# EAGLE design untitled (EAGLE 6.3)

## Sheet 1 of 2
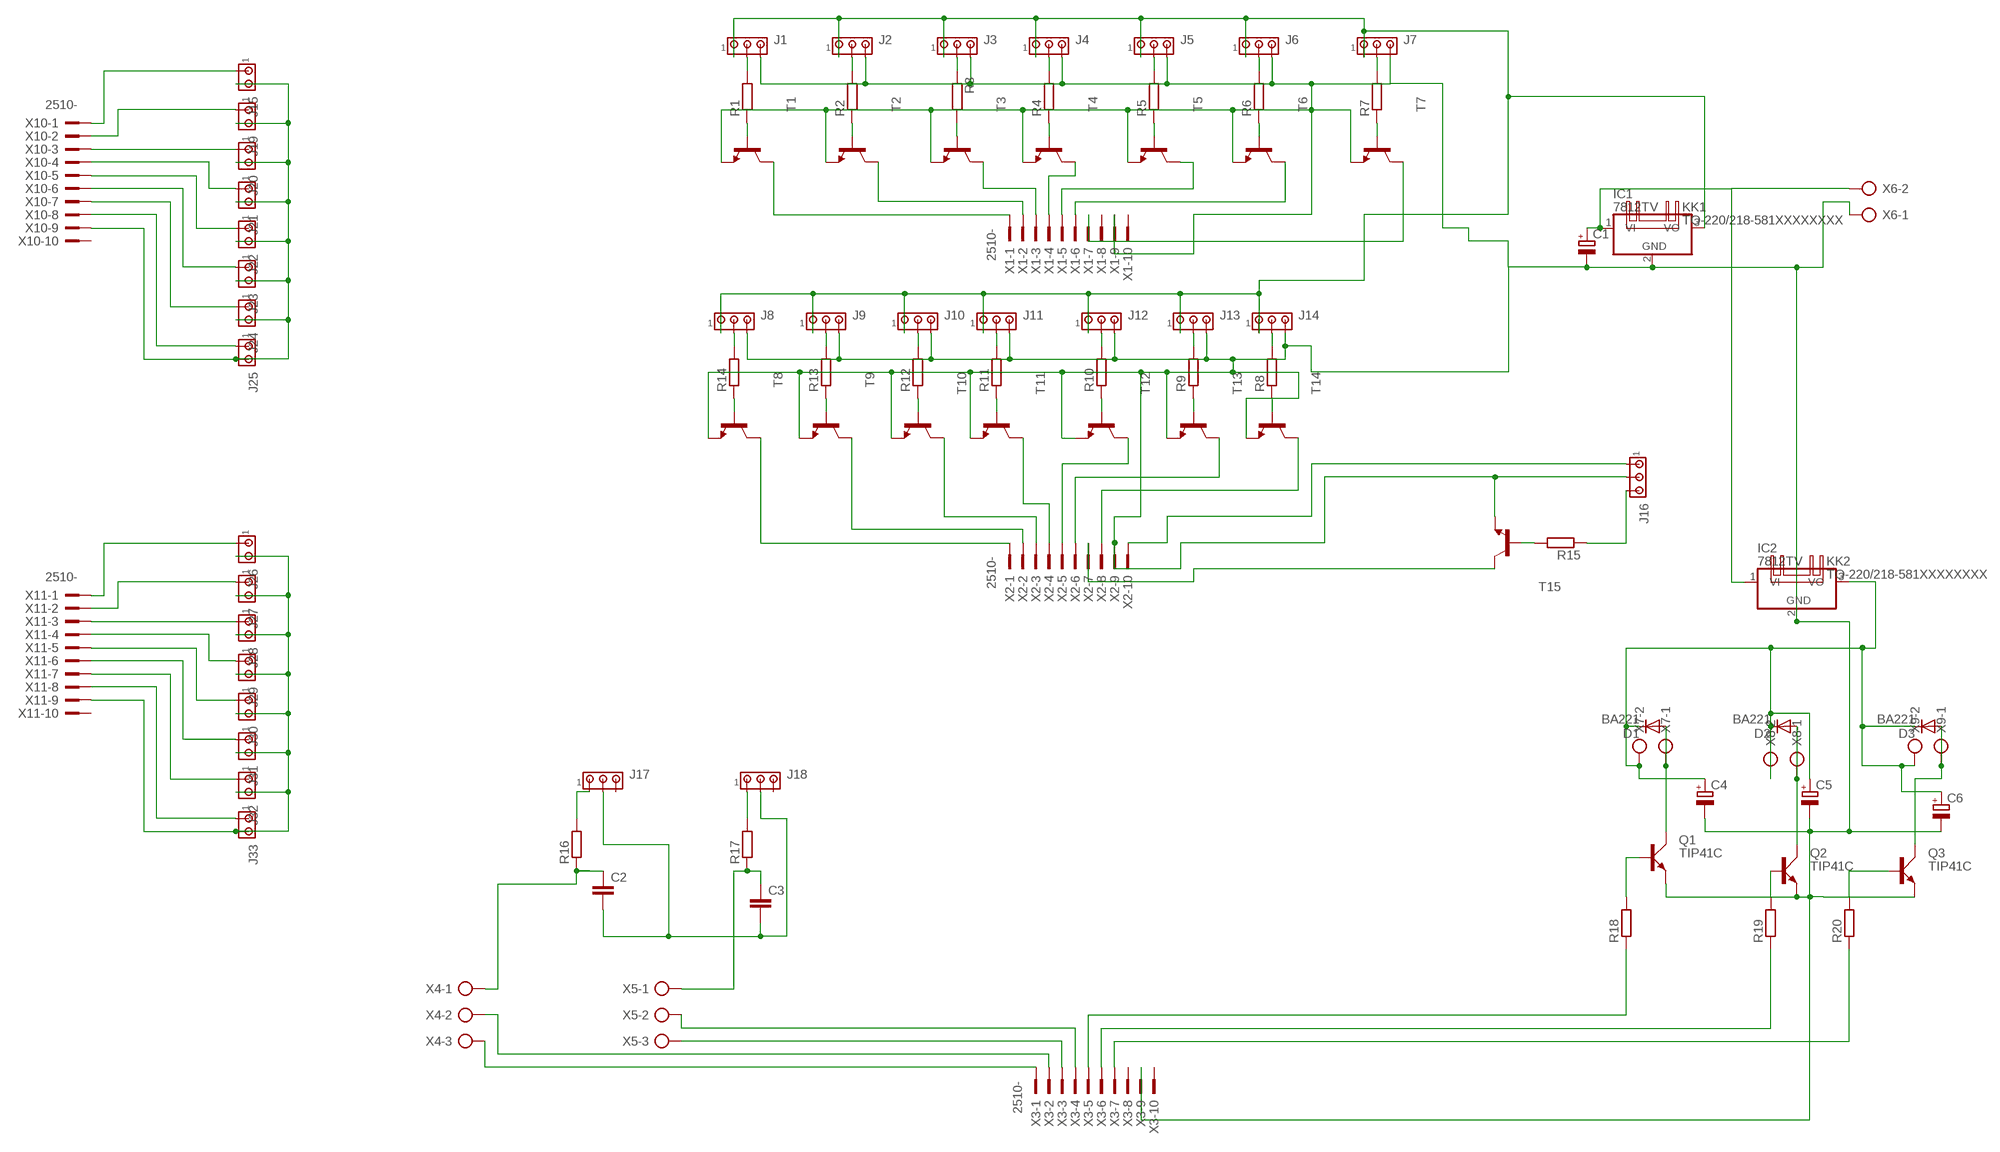
[diagram p0: schematic, sheet 1]

### Parts
C1  CPOL-EUE5-10.5  [E5-10,5]
C2  C-EU375-192X418  [C375-192X418]
C3  C-EU375-192X418  [C375-192X418]
C4  CPOL-EUE5-13  [E5-13]
C5  CPOL-EUE5-13  [E5-13]
C6  CPOL-EUE5-13  [E5-13]
D1  BA221  [DO35-10]
D2  BA221  [DO35-10]
D3  BA221  [DO35-10]
IC1  7812TV  [TO220V]
IC2  7812TV  [TO220V]
J1  MTA03-100  [10X03MTA]
J2  MTA03-100  [10X03MTA]
J3  MTA03-100  [10X03MTA]
J4  MTA03-100  [10X03MTA]
J5  MTA03-100  [10X03MTA]
J6  MTA03-100  [10X03MTA]
J7  MTA03-100  [10X03MTA]
J8  MTA03-100  [10X03MTA]
J9  MTA03-100  [10X03MTA]
J10  MTA03-100  [10X03MTA]
J11  MTA03-100  [10X03MTA]
J12  MTA03-100  [10X03MTA]
J13  MTA03-100  [10X03MTA]
J14  MTA03-100  [10X03MTA]
J15  MTA02-100  [10X02MTA]
J16  MTA03-100  [10X03MTA]
J17  MTA03-100  [10X03MTA]
J18  MTA03-100  [10X03MTA]
J19  MTA02-100  [10X02MTA]
J20  MTA02-100  [10X02MTA]
J21  MTA02-100  [10X02MTA]
J22  MTA02-100  [10X02MTA]
J23  MTA02-100  [10X02MTA]
J24  MTA02-100  [10X02MTA]
J25  MTA02-100  [10X02MTA]
J26  MTA02-100  [10X02MTA]
J27  MTA02-100  [10X02MTA]
J28  MTA02-100  [10X02MTA]
J29  MTA02-100  [10X02MTA]
J30  MTA02-100  [10X02MTA]
J31  MTA02-100  [10X02MTA]
J32  MTA02-100  [10X02MTA]
J33  MTA02-100  [10X02MTA]
KK1  TO-220/218-581XXXXXXXX  [581XXXXXXXX]
KK2  TO-220/218-581XXXXXXXX  [581XXXXXXXX]
Q1  TIP41C  [TO220AV]
Q2  TIP41C  [TO220AV]
Q3  TIP41C  [TO220AV]
R1  R-EU_0207/10  [0207/10]
R2  R-EU_0207/10  [0207/10]
R3  R-EU_0207/10  [0207/10]
R4  R-EU_0207/10  [0207/10]
R5  R-EU_0207/10  [0207/10]
R6  R-EU_0207/10  [0207/10]
R7  R-EU_0207/10  [0207/10]
R8  R-EU_0207/10  [0207/10]
R9  R-EU_0207/10  [0207/10]
R10  R-EU_0207/10  [0207/10]
R11  R-EU_0207/10  [0207/10]
R12  R-EU_0207/10  [0207/10]
R13  R-EU_0207/10  [0207/10]
R14  R-EU_0207/10  [0207/10]
R15  R-EU_0207/10  [0207/10]
R16  R-EU_0207/10  [0207/10]
R17  R-EU_0207/10  [0207/10]
R18  R-EU_0207/10  [0207/10]
R19  R-EU_0207/10  [0207/10]
R20  R-EU_0207/10  [0207/10]
T1  2N5401-NPN-TO92-CBE  [TO92-CBE]
T2  2N5401-NPN-TO92-CBE  [TO92-CBE]
T3  2N5401-NPN-TO92-CBE  [TO92-CBE]
T4  2N5401-NPN-TO92-CBE  [TO92-CBE]
T5  2N5401-NPN-TO92-CBE  [TO92-CBE]
T6  2N5401-NPN-TO92-CBE  [TO92-CBE]
T7  2N5401-NPN-TO92-CBE  [TO92-CBE]
T8  2N5401-NPN-TO92-CBE  [TO92-CBE]
T9  2N5401-NPN-TO92-CBE  [TO92-CBE]
T10  2N5401-NPN-TO92-CBE  [TO92-CBE]
T11  2N5401-NPN-TO92-CBE  [TO92-CBE]
T12  2N5401-NPN-TO92-CBE  [TO92-CBE]
T13  2N5401-NPN-TO92-CBE  [TO92-CBE]
T14  2N5401-NPN-TO92-CBE  [TO92-CBE]
T15  2N5401-NPN-TO92-CBE  [TO92-CBE]
X1  2510-  [PAK100/2500-10]
X2  2510-  [PAK100/2500-10]
X3  2510-  [PAK100/2500-10]
X4  AK300/3  [AK300/3]
X5  AK300/3  [AK300/3]
X6  AK300/2  [AK300/2]
X7  AK300/2  [AK300/2]
X8  AK300/2  [AK300/2]
X9  AK300/2  [AK300/2]
X10  2510-  [PAK100/2500-10]
X11  2510-  [PAK100/2500-10]

### Nets
N$1: R3.2 T3.B
N$2: R1.1 T1.B
N$3: J2.2 R2.2
N$4: J8.2 R14.2
N$5: J1.2 R1.2
N$6: R2.1 T2.B
N$7: J3.2 R3.1
N$8: J4.2 R4.2
N$9: R4.1 T4.B
N$10: R5.1 T5.B
N$11: J5.2 R5.2
N$12: J6.2 R6.2
N$13: R6.1 T6.B
N$14: J7.2 R7.2
N$15: R7.1 T7.B
N$16: J13.2 R9.2
N$17: R9.1 T13.B
N$18: R8.1 T14.B
N$19: J14.2 R8.2
N$20: J12.2 R10.2
N$21: R10.1 T12.B
N$22: R11.1 T11.B
N$23: J11.2 R11.2
N$24: J10.2 R12.2
N$25: R12.1 T10.B
N$26: R13.1 T9.B
N$27: J9.2 R13.2
N$28: R14.1 T8.B
N$29: T5.C X1.5
N$30: T8.C X2.1
N$31: T9.C X2.2
N$32: T1.C X1.1
N$33: T10.C X2.3
N$34: T11.C X2.4
N$35: T12.C X2.5
N$37: T13.C X2.6
N$38: J16.1 X2.10
N$39: T2.C X1.2
N$40: T3.C X1.3
N$41: T4.C X1.4
N$43: T6.C X1.6
N$44: T7.C X1.7
N$46: D1.A Q1.C X7.1
N$47: IC1.3(VO) J1.1 J2.1 J3.1 J4.1 J5.1 J6.1 J7.1 J8.1 J9.1 J10.1 J11.1 J12.1 J13.1 J14.1
N$48: T14.C X2.8
N$49: C1.+ IC1.1(VI) IC2.1(VI) X6.2
N$51: J16.3 R15.1
N$52: R15.2 T15.B
N$53: T15.C X2.7
N$54: Q1.B R18.2
N$55: D2.A Q2.C X8.1
N$56: Q2.B R19.2
N$57: Q3.B R20.2
N$58: C1.- C4.- C5.- C6.- IC1.2(GND) IC2.2(GND) J1.3 J2.3 J3.3 J4.3 J5.3 J6.3 J7.3 J8.3 J9.3 J10.3 J11.3 J12.3 J13.3 J14.3 J16.2 Q1.E Q2.E Q3.E T1.E T2.E T3.E T4.E T5.E T6.E T7.E T8.E T9.E T10.E T11.E T12.E T13.E T14.E T15.E X1.9 X2.9 X3.9 X6.1
N$59: D3.A Q3.C X9.1
N$60: J17.1 R16.2
N$61: C4.+ C5.+ C6.+ D1.C D2.C D3.C IC2.3(VO) X7.2 X8.2 X9.2
N$62: C2.1 R16.1 X4.1
N$63: J18.1 R17.2
N$64: C3.1 R17.1 X5.1
N$65: C2.2 C3.2 J17.2 J18.2
N$68: J15.1 X10.1
N$69: J19.1 X10.2
N$70: X3.1 X4.3
N$71: X3.2 X4.2
N$72: X3.3 X5.3
N$73: X3.4 X5.2
N$74: R18.1 X3.5
N$75: R19.1 X3.6
N$76: R20.1 X3.7
N$77: J20.1 X10.3
N$78: J21.1 X10.4
N$79: J22.1 X10.5
N$80: J23.1 X10.6
N$81: J24.1 X10.7
N$82: J25.1 X10.8
N$83: J15.2 J19.2 J20.2 J21.2 J22.2 J23.2 J24.2 J25.2 X10.9
N$84: J26.1 X11.1
N$85: J27.1 X11.2
N$86: J28.1 X11.3
N$87: J29.1 X11.4
N$88: J30.1 X11.5
N$89: J31.1 X11.6
N$90: J32.1 X11.7
N$91: J33.1 X11.8
N$92: J26.2 J27.2 J28.2 J29.2 J30.2 J31.2 J32.2 J33.2 X11.9
Unconnected: J17.3 J18.3 X1.8 X1.10 X3.8 X3.10 X10.10 X11.10

## Sheet 2 of 2
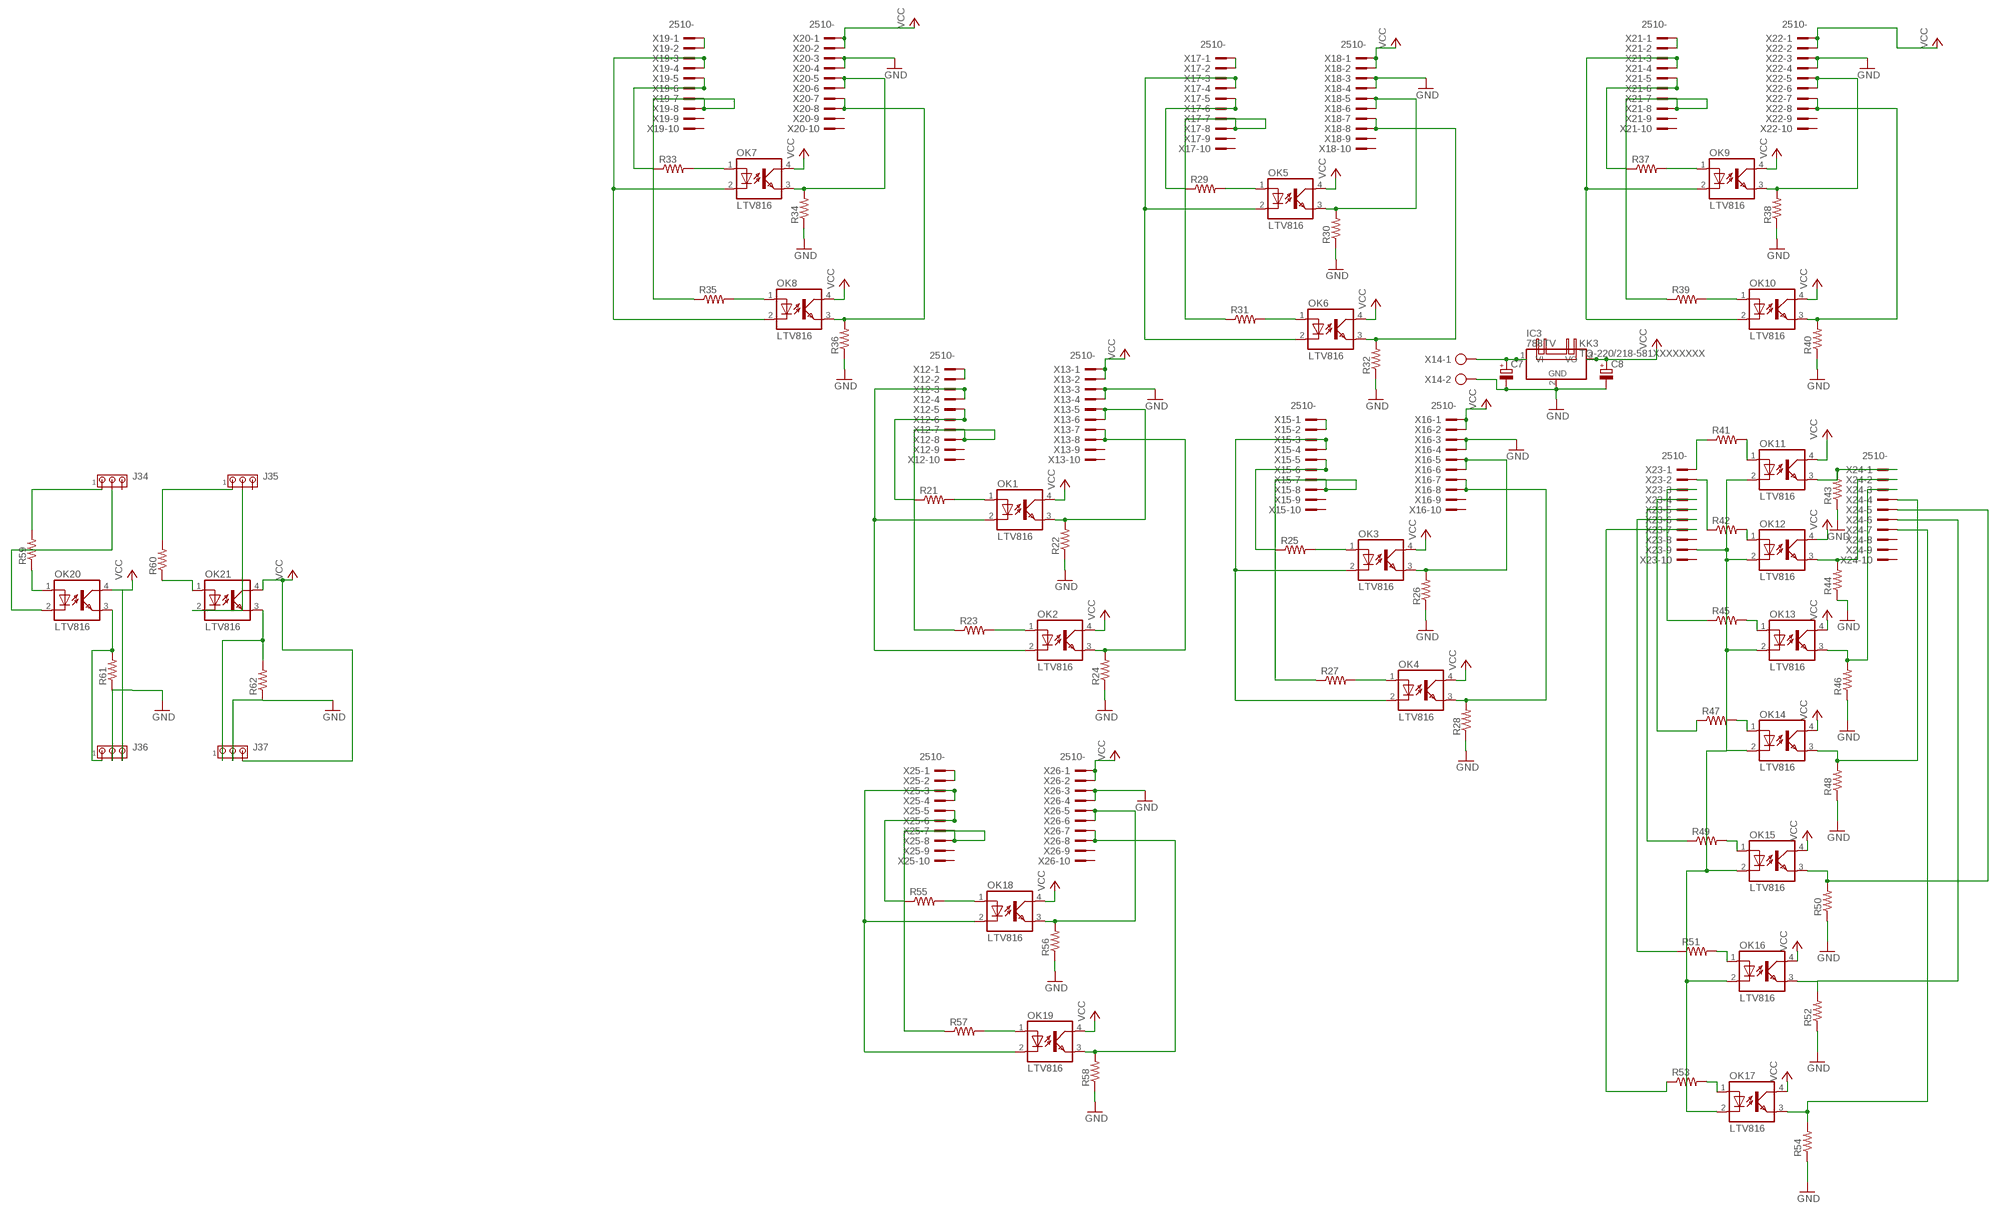
[diagram p1: schematic, sheet 2]

### Parts
C7  CPOL-EUE5-13  [E5-13]
C8  CPOL-EUE5-10.5  [E5-10,5]
IC3  788TV  [TO220V]
J34  MTA03-100  [10X03MTA]
J35  MTA03-100  [10X03MTA]
J36  MTA03-100  [10X03MTA]
J37  MTA03-100  [10X03MTA]
KK3  TO-220/218-581XXXXXXXX  [581XXXXXXXX]
OK1  LTV816  [DIL04]
OK2  LTV816  [DIL04]
OK3  LTV816  [DIL04]
OK4  LTV816  [DIL04]
OK5  LTV816  [DIL04]
OK6  LTV816  [DIL04]
OK7  LTV816  [DIL04]
OK8  LTV816  [DIL04]
OK9  LTV816  [DIL04]
OK10  LTV816  [DIL04]
OK11  LTV816  [DIL04]
OK12  LTV816  [DIL04]
OK13  LTV816  [DIL04]
OK14  LTV816  [DIL04]
OK15  LTV816  [DIL04]
OK16  LTV816  [DIL04]
OK17  LTV816  [DIL04]
OK18  LTV816  [DIL04]
OK19  LTV816  [DIL04]
OK20  LTV816  [DIL04]
OK21  LTV816  [DIL04]
R21  R-US_0207/10  [0207/10]
R22  R-US_0207/10  [0207/10]
R23  R-US_0207/10  [0207/10]
R24  R-US_0207/10  [0207/10]
R25  R-US_0207/10  [0207/10]
R26  R-US_0207/10  [0207/10]
R27  R-US_0207/10  [0207/10]
R28  R-US_0207/10  [0207/10]
R29  R-US_0207/10  [0207/10]
R30  R-US_0207/10  [0207/10]
R31  R-US_0207/10  [0207/10]
R32  R-US_0207/10  [0207/10]
R33  R-US_0207/10  [0207/10]
R34  R-US_0207/10  [0207/10]
R35  R-US_0207/10  [0207/10]
R36  R-US_0207/10  [0207/10]
R37  R-US_0207/10  [0207/10]
R38  R-US_0207/10  [0207/10]
R39  R-US_0207/10  [0207/10]
R40  R-US_0207/10  [0207/10]
R41  R-US_0207/10  [0207/10]
R42  R-US_0207/10  [0207/10]
R43  R-US_0207/10  [0207/10]
R44  R-US_0207/10  [0207/10]
R45  R-US_0207/10  [0207/10]
R46  R-US_0207/10  [0207/10]
R47  R-US_0207/10  [0207/10]
R48  R-US_0207/10  [0207/10]
R49  R-US_0207/10  [0207/10]
R50  R-US_0207/10  [0207/10]
R51  R-US_0207/10  [0207/10]
R52  R-US_0207/10  [0207/10]
R53  R-US_0207/10  [0207/10]
R54  R-US_0207/10  [0207/10]
R55  R-US_0207/10  [0207/10]
R56  R-US_0207/10  [0207/10]
R57  R-US_0207/10  [0207/10]
R58  R-US_0207/10  [0207/10]
R59  R-US_0207/10  [0207/10]
R60  R-US_0207/10  [0207/10]
R61  R-US_0207/10  [0207/10]
R62  R-US_0207/10  [0207/10]
X12  2510-  [PAK100/2500-10]
X13  2510-  [PAK100/2500-10]
X14  AK300/2  [AK300/2]
X15  2510-  [PAK100/2500-10]
X16  2510-  [PAK100/2500-10]
X17  2510-  [PAK100/2500-10]
X18  2510-  [PAK100/2500-10]
X19  2510-  [PAK100/2500-10]
X20  2510-  [PAK100/2500-10]
X21  2510-  [PAK100/2500-10]
X22  2510-  [PAK100/2500-10]
X23  2510-  [PAK100/2500-10]
X24  2510-  [PAK100/2500-10]
X25  2510-  [PAK100/2500-10]
X26  2510-  [PAK100/2500-10]

### Nets
GND: C7.- C8.- IC3.2(GND) J36.2 J37.2 R22.1 R24.1 R26.1 R28.1 R30.1 R32.1 R34.1 R36.1 R38.1 R40.1 R43.1 R44.1 R46.1 R48.1 R50.1 R52.1 R54.1 R56.1 R58.1 R61.1 R62.1 X13.3 X13.4 X14.2 X16.3 X16.4 X18.3 X18.4 X20.3 X20.4 X22.3 X22.4 X26.3 X26.4
N$95: X12.1 X12.2
N$96: R21.1 X12.5 X12.6
N$97: C7.+ IC3.1(VI) X14.1
N$98: OK1.1(A) R21.2
N$99: OK1.3(EMIT) R22.2 X13.5 X13.6
N$100: OK1.2(C) OK2.2(C) X12.3 X12.4
N$101: R23.1 X12.7 X12.8
N$102: OK2.1(A) R23.2
N$103: OK2.3(EMIT) R24.2 X13.7 X13.8
N$104: X15.1 X15.2
N$105: R25.1 X15.5 X15.6
N$106: OK3.1(A) R25.2
N$107: OK3.3(EMIT) R26.2 X16.5 X16.6
N$108: OK3.2(C) OK4.2(C) X15.3 X15.4
N$109: R27.1 X15.7 X15.8
N$110: OK4.1(A) R27.2
N$111: OK4.3(EMIT) R28.2 X16.7 X16.8
N$112: X17.1 X17.2
N$113: R29.1 X17.5 X17.6
N$114: OK5.1(A) R29.2
N$115: OK5.3(EMIT) R30.2 X18.5 X18.6
N$116: OK5.2(C) OK6.2(C) X17.3 X17.4
N$117: R31.1 X17.7 X17.8
N$118: OK6.1(A) R31.2
N$119: OK6.3(EMIT) R32.2 X18.7 X18.8
N$120: X19.1 X19.2
N$121: R33.1 X19.5 X19.6
N$122: OK7.1(A) R33.2
N$123: OK7.3(EMIT) R34.2 X20.5 X20.6
N$124: OK7.2(C) OK8.2(C) X19.3 X19.4
N$125: R35.1 X19.7 X19.8
N$126: OK8.1(A) R35.2
N$127: OK8.3(EMIT) R36.2 X20.7 X20.8
N$128: X21.1 X21.2
N$129: R37.1 X21.5 X21.6
N$130: OK9.1(A) R37.2
N$131: OK9.3(EMIT) R38.2 X22.5 X22.6
N$132: OK9.2(C) OK10.2(C) X21.3 X21.4
N$133: R39.1 X21.7 X21.8
N$134: OK10.1(A) R39.2
N$135: OK10.3(EMIT) R40.2 X22.7 X22.8
N$136: R41.1 X23.1
N$137: OK11.1(A) R41.2
N$138: R42.1 X23.2
N$139: OK12.1(A) R42.2
N$140: R45.1 X23.3
N$141: OK13.1(A) R45.2
N$142: OK11.3(EMIT) R43.2 X24.1
N$143: OK12.3(EMIT) R44.2 X24.2
N$144: OK13.3(EMIT) R46.2 X24.3
N$145: OK14.1(A) R47.2
N$146: OK14.3(EMIT) R48.2 X24.4
N$147: OK15.1(A) R49.2
N$148: OK15.3(EMIT) R50.2 X24.5
N$149: OK16.1(A) R51.2
N$150: OK17.1(A) R53.2
N$151: OK11.2(C) OK12.2(C) OK13.2(C) OK14.2(C) OK15.2(C) OK16.2(C) OK17.2(C) X23.9
N$152: OK17.3(EMIT) R54.2 X24.7
N$153: R47.1 X23.4
N$154: R49.1 X23.5
N$155: R51.1 X23.6
N$156: R53.1 X23.7
N$157: OK16.3(EMIT) R52.2 X24.6
N$158: X25.1 X25.2
N$159: R55.1 X25.5 X25.6
N$160: OK18.1(A) R55.2
N$161: OK18.3(EMIT) R56.2 X26.5 X26.6
N$162: OK18.2(C) OK19.2(C) X25.3 X25.4
N$163: R57.1 X25.7 X25.8
N$164: OK19.1(A) R57.2
N$165: OK19.3(EMIT) R58.2 X26.7 X26.8
N$166: J34.1 R59.2
N$167: OK20.1(A) R59.1
N$168: J34.2 OK20.2(C)
N$169: J36.1 OK20.3(EMIT) R61.2
N$170: J35.1 R60.2
N$171: OK21.1(A) R60.1
N$172: J35.2 OK21.2(C)
N$173: J37.1 OK21.3(EMIT) R62.2
VCC: C8.+ IC3.3(VO) J36.3 J37.3 OK1.4(COL) OK2.4(COL) OK3.4(COL) OK4.4(COL) OK5.4(COL) OK6.4(COL) OK7.4(COL) OK8.4(COL) OK9.4(COL) OK10.4(COL) OK11.4(COL) OK12.4(COL) OK13.4(COL) OK14.4(COL) OK15.4(COL) OK16.4(COL) OK17.4(COL) OK18.4(COL) OK19.4(COL) OK20.4(COL) OK21.4(COL) X13.1 X13.2 X16.1 X16.2 X18.1 X18.2 X20.1 X20.2 X22.1 X22.2 X26.1 X26.2
Unconnected: J34.3 J35.3 X12.9 X12.10 X13.9 X13.10 X15.9 X15.10 X16.9 X16.10 X17.9 X17.10 X18.9 X18.10 X19.9 X19.10 X20.9 X20.10 X21.9 X21.10 X22.9 X22.10 X23.8 X23.10 X24.8 X24.9 X24.10 X25.9 X25.10 X26.9 X26.10

## Library data of the parts
C1 C7 C8 = qfm-trx1-24g:CPOL-EU: POLARIZED CAPACITOR, European symbol
C2 C3 = qfm-trx1-24g:C-EU: CAPACITOR, European symbol
C4-C6 = resistor:CPOL-EU: POLARIZED CAPACITOR, European symbol
D1-D3 = diode:BA221: DIODE high speed (Philips)
IC1-IC3 = linear:78*: Positive VOLTAGE REGULATOR Source: http://cache.national.com/ds/LM/LM78L05.pdf http://www.fairchildsemi.com/ds/LM/LM7805.pdf
J1-J14 J16-J18 J34-J37 = con-amp:MTA03-100: AMP connector
J15 J19-J33 = con-amp:MTA02-100: AMP connector
KK1-KK3 = heatsink-aavid:TO-220/218: HEATSINKS TO-220/218
OK1-OK21 = optocoupler:LTV816: OPTO COUPLER Source: LITEON, LTV816.pdf; OC_FARNELL: unknown; OC_NEWARK: unknown
Q1-Q3 = transistor-power:TIP41C: NPN TRANSISTOR
R1-R20 = rcl:R-EU_: RESISTOR, European symbol
R21-R62 = rcl:R-US_: RESISTOR, American symbol
T1-T15 = transistor:*-NPN-: NPN Transistror BF959 corrected 2008.03.06
X1-X3 X10-X13 X15-X26 = con-3m:2510-: 3M (TM) Pak 100 4-Wall Header Source: 3M; MF: 3M; MPN: 2510-6002UB; OC_FARNELL: 9838244; OC_NEWARK: 46F4725
X4 X5 = con-ptr500:AK300/3: CONNECTOR; OC_FARNELL: unknown; OC_NEWARK: unknown
X6-X9 X14 = con-ptr500:AK300/2: CONNECTOR; OC_FARNELL: unknown; OC_NEWARK: unknown

## Board
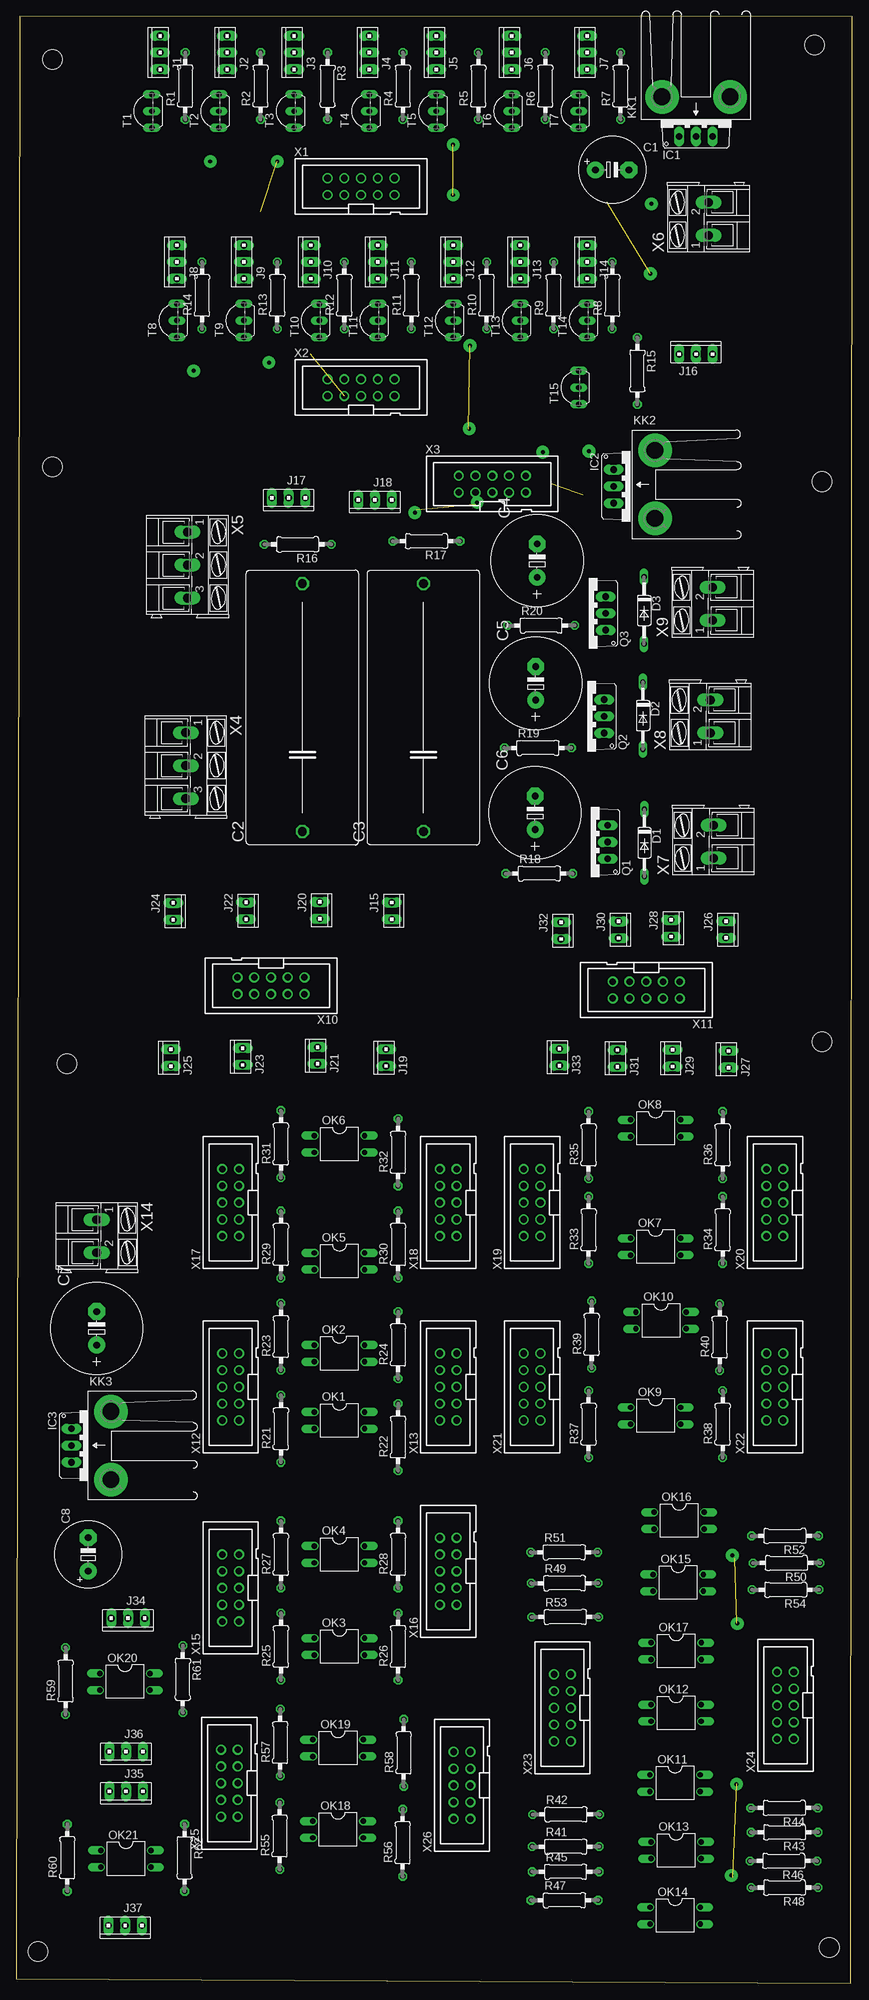
[diagram p2: board, top side]
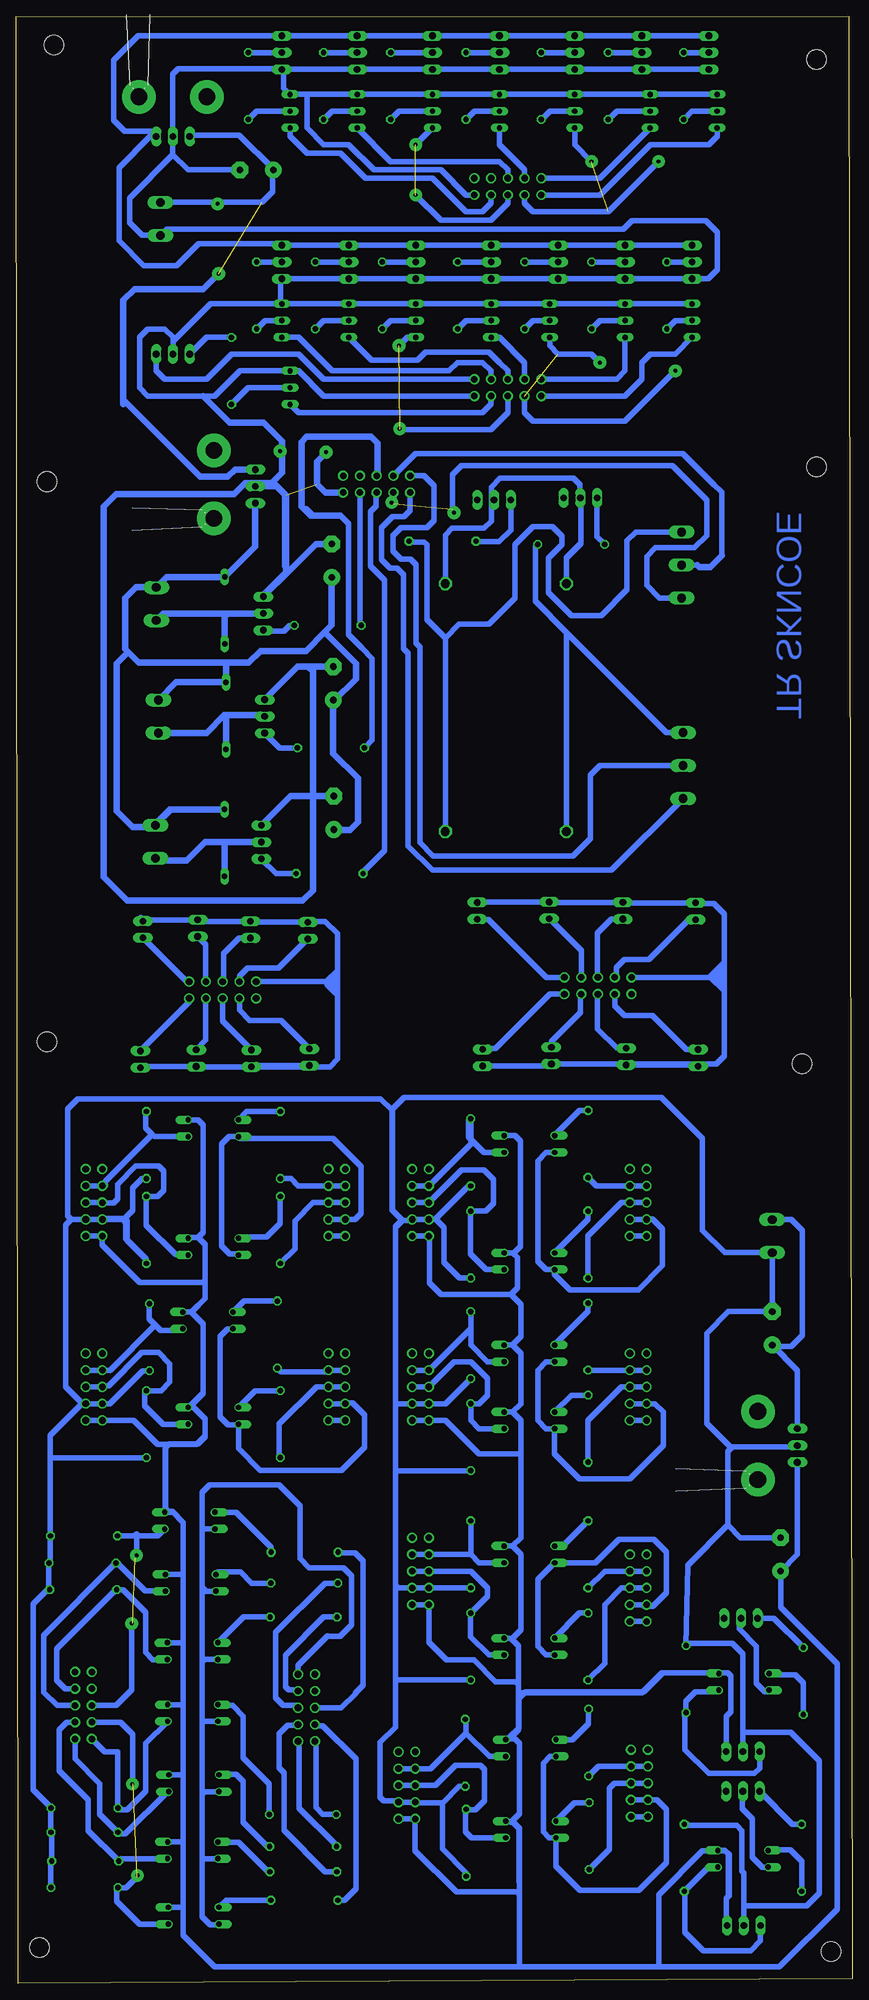
[diagram p3: board, bottom side, seen from below]

Size 126.8 x 298.2 mm. Coordinates in mm from the lower left corner, seen from the top.
Outline: 0,0.64 126.53,0 126.8,298.19 0.53,298.2 0,0.64
Copper layers (1*16): Top 0.035mm / dielectric 1.5mm / Bottom 0.035mm
Design rules "default": minimum track width 10mil, minimum drill 24mil, track to track 8mil, track to pad 8mil, pad to pad 8mil, via to via 8mil, smd to smd 8mil, copper to edge 40mil, drill to drill 8mil, minimum pad ring 10mil, minimum via ring 8mil, stop-mask expansion 4mil, vias tented up to drill 0mil, thermal gap 10mil
Holes 3 mm at 5.47,291.66 121.08,293.87 122.18,142.72 7.67,139.41 3.27,4.81 123.28,5.36 122.18,227.67 5.47,229.88

### Footprints (pad centres in the part's own frame; a part is rotated, then mirrored left to right if it is on the bottom)
E5-10,5 = drill 1.016 pad 2.54: + -2.54,0 | drill 1.016 pad 2.54 octagon: - 2.54,0
C375-192X418 = drill 1.321 octagon: 1 -18.796,0; 2 18.796,0
E5-13 = drill 1.016 pad 2.54: + -2.54,0 | drill 1.016 pad 2.54 octagon: - 2.54,0
DO35-10 = drill 0.813 long: A 5.08,0; C -5.08,0
TO220V = drill 1.016 long: 1 -2.54,-2.54; 2 0,-2.54; 3 2.54,-2.54
10X03MTA = drill 1.016 long: 1 2.54,0; 2 0,0; 3 -2.54,0
10X02MTA = drill 1.016 long: 1 1.27,0; 2 -1.27,0
581XXXXXXXX = drill 2.54 pad 5.08: A2,5 -5.16,3.45; B2,5 5.16,3.45
DIL04 = drill 0.813 offset: 1 -1.27,-3.81; 2 1.27,-3.81; 3 1.27,3.81; 4 -1.27,3.81
TO220AV = drill 1.016 long: B -2.54,-2.54; C 0,-2.54; E 2.54,-2.54
0207/10 = drill 0.813 octagon: 1 -5.08,0; 2 5.08,0
TO92-CBE = drill 0.813 long: B 0,0; C -2.54,0; E 2.54,0
PAK100/2500-10 = drill 1 pad 1.422: 1 -5.08,-1.27; 2 -5.08,1.27; 3 -2.54,-1.27; 4 -2.54,1.27; 5 0,-1.27; 6 0,1.27; 7 2.54,-1.27; 8 2.54,1.27; 9 5.08,-1.27; 10 5.08,1.27
AK300/3 = drill 1.321 long: 1 -5.004,0; 2 0,0; 3 5.004,0
AK300/2 = drill 1.321 long: 1 -2.515,0; 2 2.489,0

### Placement (x,y rotation side)
C1  90.37,274.94 0 top
C2  43.38,193.41 90 top
C3  61.74,193.41 90 top
C4  78.98,215.68 90 top
C5  78.75,197.09 90 top
C6  78.67,177.45 90 top
C7  12.16,99.28 90 top
C8  10.89,64.99 90 top
D1  95.24,172.9 270 top
D2  95.02,192.17 270 top
D3  95.19,208.13 270 top
IC1  103.07,282.56 0 top
IC2  93.12,226.94 270 top
IC3  10.89,81.5 270 top
J1  21.79,292.72 90 top
J2  31.95,292.72 90 top
J3  42.11,292.72 90 top
J4  53.54,292.72 90 top
J5  63.7,292.72 90 top
J6  75.13,292.72 90 top
J7  86.56,292.72 90 top
J8  24.33,260.97 90 top
J9  34.49,260.97 90 top
J10  44.65,260.97 90 top
J11  54.81,260.97 90 top
J12  66.24,260.97 90 top
J13  76.4,260.97 90 top
J14  86.56,260.97 90 top
J15  56.92,162.58 270 top
J16  103.07,247 0 top
J17  41.27,225.2 180 top
J18  54.36,224.89 180 top
J19  56.06,140.32 90 top
J20  45.99,162.66 270 top
J21  45.66,140.64 90 top
J22  34.82,162.6 270 top
J23  34.31,140.48 90 top
J24  23.77,162.52 270 top
J25  23.42,140.3 90 top
J26  107.61,159.75 270 top
J27  108.01,140.06 90 top
J28  99.31,159.95 270 top
J29  99.54,140.24 90 top
J30  91.32,159.73 270 top
J31  91.15,140.21 90 top
J32  82.6,159.58 270 top
J33  82.36,140.39 90 top
J34  16.91,55.31 180 top
J35  16.62,29.07 180 top
J36  16.62,35.1 180 top
J37  16.48,8.72 180 top
KK1  103.07,282.56 0 top
KK2  93.39,227.24 270 top
KK3  10.89,81.5 270 top
OK1  48.99,85.31 270 top
OK2  48.99,95.47 270 top
OK3  48.99,51.02 270 top
OK4  48.99,64.99 270 top
OK5  48.99,109.44 270 top
OK6  48.99,127.22 270 top
OK7  96.95,111.65 270 top
OK8  96.95,129.61 270 top
OK9  96.95,86.01 270 top
OK10  97.76,100.47 270 top
OK11  99.89,30.3 270 top
OK12  100.06,40.95 270 top
OK13  100.06,20.12 270 top
OK14  99.92,10.21 270 top
OK15  100.37,60.68 270 top
OK16  100.51,70.12 270 top
OK17  100.07,50.34 270 top
OK18  48.77,23.28 270 top
OK19  48.78,35.62 270 top
OK20  16.45,45.68 270 top
OK21  16.6,18.84 270 top
Q1  87.13,173 90 top
Q2  86.61,192.07 90 top
Q3  86.83,207.68 90 top
R1  25.6,287.64 90 top
R2  37.03,287.64 90 top
R3  47.19,287.64 270 top
R4  58.62,287.64 90 top
R5  70.05,287.64 90 top
R6  80.21,287.64 90 top
R7  91.64,287.64 90 top
R8  90.37,255.89 90 top
R9  81.48,255.89 90 top
R10  71.32,255.89 90 top
R11  59.89,255.89 90 top
R12  49.73,255.89 90 top
R13  39.57,255.89 90 top
R14  28.14,255.89 90 top
R15  94.18,244.46 270 top
R16  42.66,218.15 180 top
R17  62.18,218.64 180 top
R18  79.31,168.23 0 top
R19  79.09,187.29 0 top
R20  79.6,205.85 0 top
R21  40.1,84.04 90 top
R22  57.88,82.77 90 top
R23  40.1,98.01 90 top
R24  57.88,96.74 90 top
R25  40.1,51.02 90 top
R26  57.88,51.02 90 top
R27  40.1,64.99 90 top
R28  57.88,64.99 90 top
R29  40.1,111.98 90 top
R30  57.88,111.98 90 top
R31  40.1,127.22 90 top
R32  57.88,125.95 90 top
R33  86.79,114.19 90 top
R34  107.11,114.19 90 top
R35  86.79,127.07 90 top
R36  107.11,127.07 90 top
R37  86.79,84.74 90 top
R38  107.11,84.74 90 top
R39  87.25,98.34 90 top
R40  106.65,97.93 90 top
R41  83.32,20.67 0 top
R42  83.36,25.56 0 top
R43  116.5,22.86 180 top
R44  116.47,26.55 180 top
R45  83.31,16.87 0 top
R46  116.37,18.51 180 top
R47  83.13,12.55 0 top
R48  116.5,14.48 180 top
R49  83.15,60.64 0 top
R50  116.79,63.68 180 top
R51  83.09,65.32 0 top
R52  116.56,67.8 180 top
R53  83.25,55.5 0 top
R54  116.67,59.64 180 top
R55  39.93,22.28 90 top
R56  58.59,21.26 90 top
R57  40.01,36.46 90 top
R58  58.74,34.9 90 top
R59  7.44,45.78 90 top
R60  7.7,19 90 top
R61  25.24,46.07 270 top
R62  25.5,19 270 top
T1  20.52,283.83 90 top
T2  30.68,283.83 90 top
T3  42.11,283.83 90 top
T4  53.54,283.83 90 top
T5  63.7,283.83 90 top
T6  75.13,283.83 90 top
T7  85.29,283.83 90 top
T8  24.33,252.08 90 top
T9  34.49,252.08 90 top
T10  45.92,252.08 90 top
T11  54.81,252.08 90 top
T12  66.24,252.08 90 top
T13  76.4,252.08 90 top
T14  86.56,252.08 90 top
T15  85.29,241.92 90 top
X1  52.27,272.4 0 top
X2  52.27,241.92 0 top
X3  72.17,227.29 0 top
X4  25.67,184.61 270 top
X5  25.92,215.01 270 top
X6  104.98,267.51 90 top
X7  105.73,173.07 90 top
X8  105.25,192.07 90 top
X9  105.6,209.13 90 top
X10  38.6,151.23 180 top
X11  95.53,150.58 180 top
X12  32.48,90.39 90 top
X13  65.5,90.39 90 top
X14  12.16,113.25 270 top
X15  32.48,59.91 90 top
X16  65.5,62.45 90 top
X17  32.48,118.33 90 top
X18  65.5,118.33 90 top
X19  78.2,118.33 90 top
X20  115.03,118.33 90 top
X21  78.2,90.39 90 top
X22  115.03,90.39 90 top
X23  82.81,41.73 90 top
X24  116.64,42.08 90 top
X25  32.3,30.31 90 top
X26  67.58,29.97 90 top

### Tracks (layer width: path | path; a pad name or v marks a point on that pad's centre or on a via)
GND
  Bottom 0.813: R22.1 69.08,77.69 69.31,77.92 | 69.31,87.85 69.31,77.92 | 68.04,59.91 X16.3 X16.4 R28.1 68.95,59.91 69.31,60.27 | R24.1 61.69,87.85 X13.4 X13.3 69.31,87.85 | R32.1 58.24,120.87 63.25,115.87 | 63.25,115.87 64.15,115.87 X18.4 X18.3 66.92,115.64 68.27,115.64 | R30.1 59.61,106.9 61.95,109.24 61.95,114.57 63.25,115.87 | 69.31,87.85 69.31,114.6 | 69.31,114.6 68.27,115.64 | 68.27,115.64 69.79,117.16 69.79,132.56 68.04,134.31 28.98,134.31 22.74,128.07 22.74,114.12 19.38,110.76 X14.2 C7.- 18.82,101.82 22.1,98.54 22.1,84.83 18.55,81.29 18.22,81.29 | X20.3 114.26,115.79 | 114.26,115.79 X20.4 | R36.1 107.76,121.99 109.16,120.59 109.16,117.16 110.37,115.95 | 110.37,115.95 114.1,115.95 114.26,115.79 | 110.37,115.95 109.99,115.56 109.99,112.59 107.11,109.71 R34.1 107.11,109.81 110.21,112.91 110.21,115.28 110.72,115.79 118.48,115.79 | R40.1 107.63,92.85 112.67,87.8 113.72,87.8 X22.4 X22.3 116.34,87.88 116.79,87.88 | 18.22,81.29 8.57,81.29 IC3.2 | C8.- 16.97,67.53 18.89,69.45 | 18.89,69.45 18.89,80.61 18.22,81.29 | 118.48,115.79 119.32,114.94 119.32,90.41 116.79,87.88 | 69.31,114.6 69.31,114.7 68.31,115.71 69.85,117.25 69.85,132.37 71.56,134.08 117.5,134.08 119.04,132.54 119.04,116.35 118.48,115.79 | R58.1 59.65,29.82 62.12,27.35 | 62.12,27.35 66.23,27.35 X26.4 X26.3 69.02,27.6 71.1,27.6 71.64,28.14 71.64,36.46 69.31,38.79 69.31,45.86 | R56.1 58.59,16.72 62.2,20.33 62.2,27.27 62.12,27.35 | 69.31,77.92 69.31,60.27 | 69.31,60.27 69.31,45.86 | R26.1 69.24,45.94 69.31,45.86 | R48.1 121.58,18.37 R46.1 121.45,22.72 R43.1 121.58,26.51 R44.1 | 121.75,26.75 R44.1 | R44.1 124.26,29.26 124.26,57.53 122.15,59.64 R54.1 121.87,59.76 R50.1 121.64,63.91 R52.1 121.64,79.89
  Bottom 0.813: 18.89,69.45 24.98,63.36 R61.1 24.88,51.51 18.19,51.51 16.62,49.94 J36.2 16.62,38.01 16.58,38.05 9.35,38.05 5.03,33.73 5.03,13.6 6.89,11.73 16.4,11.73 16.48,11.81 | J37.2 16.48,11.81 | 16.48,11.81 16.48,16.69 16.74,16.95 16.74,23.1 17.53,23.9 25.32,23.9 R62.1 | 121.64,79.89 121.64,83.03 116.79,87.88 | R38.1 121.41,79.65 121.64,79.89
N$1
  Bottom 0.813: R3.2 45.92,283.83 T3.B
N$2
  Bottom 0.813: R1.1 24.33,283.83 T1.B
N$3
  Bottom 0.813: R2.2 J2.2
N$4
  Bottom 0.813: J8.2 R14.2
N$5
  Bottom 0.813: R1.2 J1.2
N$6
  Bottom 0.813: R2.1 35.76,283.83 T2.B
N$7
  Bottom 0.813: R3.1 J3.2
N$8
  Bottom 0.813: R4.2 J4.2
N$9
  Bottom 0.813: R4.1 57.35,283.83 T4.B
N$10
  Bottom 0.813: R5.1 68.78,283.83 T5.B
N$11
  Bottom 0.813: R5.2 J5.2
N$12
  Bottom 0.813: R6.2 J6.2
N$13
  Bottom 0.813: R6.1 78.94,283.83 T6.B
N$14
  Bottom 0.813: R7.2 J7.2
N$15
  Bottom 0.813: R7.1 90.37,283.83 T7.B
N$16
  Bottom 0.813: J13.2 R9.2
N$17
  Bottom 0.813: R9.1 80.21,252.08 T13.B
N$18
  Bottom 0.813: R8.1 89.1,252.08 T14.B
N$19
  Bottom 0.813: R8.2 J14.2
N$20
  Bottom 0.813: J12.2 R10.2
N$21
  Bottom 0.813: T12.B 70.05,252.08 R10.1
N$22
  Bottom 0.813: T11.B 58.62,252.08 R11.1
N$23
  Bottom 0.813: J11.2 R11.2
N$24
  Bottom 0.813: J10.2 R12.2
N$25
  Bottom 0.813: T10.B 48.46,252.08 R12.1
N$26
  Bottom 0.813: T9.B 38.3,252.08 R13.1
N$27
  Bottom 0.813: J9.2 R13.2
N$28
  Bottom 0.813: T8.B 26.87,252.08 R14.1
N$29  (via drill 0.6 pad 1.93)  (1 unrouted)
  Bottom 0.813: X1.5 52.27,269.86 54.81,267.32 62.43,267.32 v66.24,271.13 | T5.C v66.24,278.75
N$30
  Bottom 0.813: X2.1 34.49,240.65 31.95,243.19 31.95,245.73 30.68,247 26.87,247 T8.C
N$31
  Bottom 0.813: T9.C 34.49,244.46 35.76,243.19 X2.2
N$32
  Bottom 0.813: T1.C 20.52,280.02 21.79,278.75 30.68,278.75 38.3,271.13 X1.1
N$33  (via drill 0.6 pad 1.93)  (1 unrouted)
  Bottom 0.813: T10.C 45.92,248.27 44.65,247 39.57,247 v38.3,245.73 | X2.3 49.73,238.11 48.46,236.84 34.49,236.84 v26.87,244.46
N$34
  Bottom 0.813: X2.4 49.73,245.73 53.54,249.54 T11.C
N$35  (1 unrouted)
  Bottom 0.813: X2.5 52.27,238.11 54.81,235.57 68.51,235.57 68.59,235.65 | T12.C 67.51,249.54 68.78,248.27
N$36  (via drill 0.6 pad 1.93)
  other vias: 68.67,235.69
N$37
  Bottom 0.813: X2.6 52.27,244.46 53.54,245.73 53.56,245.73 55.1,247.27 64.77,247.27 65.99,246.06 72.91,246.06 T13.C
N$38
  Bottom 0.813: X2.10 80.21,243.19 84.02,247 94.18,247 97.99,243.19 104.34,243.19 105.61,244.46 J16.1
N$39
  Bottom 0.813: X1.2 38.3,273.67 T2.C
N$40  (via drill 0.6 pad 1.93)  (1 unrouted)
  Bottom 0.813: X1.3 49.73,269.86 48.46,268.59 37.03,268.59 v29.41,276.21 | T3.C 42.11,278.75 v39.57,276.21
N$41
  Bottom 0.813: X1.4 49.73,274.94 53.54,278.75 T4.C
N$42  (via drill 0.6 pad 1.93)
  other vias: 68.78,248.27
N$43
  Bottom 0.813: X1.6 52.27,274.94 53.54,276.21 70.05,276.21 T6.C
N$44
  Bottom 0.813: X1.7 54.81,269.86 56.08,268.59 58.62,268.59 63.7,273.67 73.86,273.67 77.67,277.48 82.75,277.48 85.29,280.02 T7.C
N$45  (via drill 0.6 pad 1.93)
  other vias: 96.3,269.77
N$46
  Bottom 1.016: Q1.C 95.51,173 | 95.51,173 98.16,173 100.99,170.18 105.36,170.18 X7.1 | D1.A 95.24,172.73 95.51,173
N$47
  Bottom 0.813: J1.1 J2.1 J3.1 J4.1 J5.1 J6.1 J7.1 108.36,295.26 112.03,291.59 112.03,282.5 110.36,280.82 106.41,280.82 IC1.3 106.52,280.02 111.25,275.29 111.25,264.18 107.48,260.41 107.45,260.44 102.51,260.44 99.17,263.78 86.83,263.78 J14.1 | J8.1 J9.1 J10.1 J11.1 J12.1 J13.1 J14.1 | 86.82,263.24 J14.1
N$48
  Bottom 0.813: X2.8 54.81,244.46 56.08,245.73 59.89,245.73 61.16,244.46 78.94,244.46 84.02,249.54 T14.C
N$49  (via drill 0.6 pad 1.93)  (1 unrouted)
  Bottom 0.813: IC1.1 100.32,280.23 93.05,280.23 87.83,275 C1.+ 87.8,274.92 87.8,274.13 87.92,274.01 87.92,271.62 89.54,270 X6.2
  Bottom 1.016: 110.6,239.44 110.6,240.06 | 110.6,240.06 110.6,255.15 108.89,256.86 98.48,256.86 v96.14,259.19 | IC2.1 93.65,229.48 94.74,228.39 98.93,228.39 110.6,240.06
N$50  (via drill 0.6 pad 1.93)
  other vias: 86.82,232.28
N$51
  Bottom 0.813: R15.1 97.99,249.54 J16.3
N$52
  Bottom 0.813: T15.B 91.64,241.92 R15.2
N$53
  Bottom 0.813: X2.7 54.81,239.38 56.08,238.11 84.02,238.11 T15.C
N$54
  Bottom 0.813: R18.2 87.44,168.23 Q1.B
N$55
  Bottom 1.016: X8.1 97.95,189.55 95.27,192.23 95.03,192.23 | 95.03,192.23 89.3,192.23 Q2.C | D2.A 95.02,192.22 95.03,192.23
N$56
  Bottom 0.813: R19.2 86.9,187.29 Q2.B
N$57
  Bottom 0.813: R20.2 85.35,205.85 86.22,204.98 89.21,204.98 Q3.B
N$58  (via drill 0.6 pad 1.93)  (1 unrouted)
  Bottom 0.813: J1.3 J2.3 J3.3 J4.3 J5.3 J6.3 | J6.3 J7.3 86.65,290.27 102.24,290.27 103.08,289.44 103.08,280.01 | J11.3 J12.3 J13.3 J14.3 87.06,258.43 86.73,258.1 86.73,254.79 T14.E | J11.3 J10.3 J9.3 J8.3 | T1.E T2.E T3.E T4.E T5.E T6.E 82.75,286.37 | X1.9 58.62,271.13 62.43,274.94 72.59,274.94 76.4,278.75 80.21,278.75 82.75,281.29 82.75,286.37 | 82.75,286.37 T7.E 86.25,287.33 86.25,290.03 86.1,290.18 J6.3 | T8.E T9.E T10.E T11.E T12.E T13.E T14.E | X2.9 80.21,240.65 84.02,244.46 T15.E 92.91,244.46 96.72,240.65 98.47,240.65 106.88,240.65 108.15,241.92 108.15,249.54 106.88,250.81 104.34,250.81 103.07,249.54 103.07,248.93 | J16.2 103.07,248.93 | 103.08,277.24 103.08,280.01 | 103.08,280.01 IC1.2 | C1.- 100.78,274.94 103.08,277.24 | 103.08,277.24 109.66,270.65 109.66,266.96 107.7,265 X6.1 104.01,265.96 34.75,265.96 33.46,267.25 22.24,267.25 20.46,265.47 20.46,259.81 21.84,258.43 J11.3 | T14.E 97.37,254.62 103.07,248.93
  Bottom 1.016: C6.- 81.9,179.99 | Q1.E 85.23,179.99 81.9,179.99 | C4.- 81.37,218.22 85.39,214.2 | 85.39,214.2 Q3.E 89.37,210.44 85.89,213.92 85.89,225.59 87.75,227.46 92.1,227.46 93.81,225.74 111.68,225.74 113.55,223.88 113.55,167.71 109.97,164.13 83.4,164.13 81.85,165.69 81.85,198.83 82.64,199.62 | C5.- 81.69,199.62 | 81.69,199.62 82.64,199.62 | Q2.E 84.14,199.62 82.64,199.62 | 81.9,179.99 81.81,180.07 81.81,199.51 81.69,199.62 | 85.39,214.2 86.04,214.85 86.04,225.59 87.4,226.94 IC2.2 91.09,227.46 88.06,227.46 86.51,229.01 86.51,233.84 89.31,236.63 94.46,236.63 98.47,240.65 | X3.9 79.95,226.02 81.22,227.3 81.22,230.72 v79.83,232.12
N$59
  Bottom 1.016: Q3.C 94.79,207.68 | 94.79,207.68 104.54,207.68 X9.1 | D3.A 95.19,207.28 94.79,207.68
N$60
  Bottom 0.813: J17.1 38.73,219.3 R16.2
N$61
  Bottom 1.016: C6.+ 78.59,174.83 76.21,174.83 75.02,176.02 75.02,182.69 78.75,186.42 C5.+ 78.51,194.54 75.32,197.74 75.32,200.08 80.06,204.82 | D1.C 103.31,177.98 | 103.31,177.98 X7.2 | X8.2 102.55,197.25 D2.C 95.02,199.85 95.39,200.21 | C4.+ 78.98,205.9 80.06,204.82 | 80.06,204.82 82.88,202 89.79,202 91.58,200.21 95.39,200.21 | 95.39,200.21 108.25,200.21 109.86,201.82 | 109.86,201.82 110.28,202.24 110.28,209.99 108.61,211.66 105.64,211.66 X9.2 104.01,213.21 D3.C 90.58,217.82 IC2.3 | 103.31,177.98 103.56,177.98 106.23,175.3 109.2,175.3 111.59,177.69 111.59,200.1 109.86,201.82
N$62
  Bottom 0.813: X4.1 28.21,189.61 43.38,204.78 | R16.1 48.11,217.78 48.11,209.51 43.38,204.78 | C2.1 43.38,204.78
N$63
  Bottom 0.813: J18.1 51.82,220.33 53.59,218.57 57.03,218.57 R17.2
N$64
  Bottom 0.813: C3.1 61.74,203.97 | R17.1 67.4,218.5 64.95,218.5 64.54,218.09 64.54,206.77 61.74,203.97 | X5.1 32.84,220.02 34.17,218.69 34.17,211.3 38.1,207.37 42.63,207.37 46.08,210.82 46.08,216.07 44.06,218.09 44.06,219.4 45.49,220.83 48.46,220.83 51.2,218.09 51.2,209.98 55.13,206.05 59.65,206.05 61.74,203.97
N$65
  Bottom 0.813: C2.2 43.38,216.15 | 43.38,216.15 41.2,218.33 41.2,224.53 41.32,224.65 41.32,225.14 J17.2 41.31,225.24 41.31,227.18 42.31,228.18 53.43,228.18 54.78,226.83 54.78,224.17 | C3.2 61.74,219.59 60.73,220.59 55.85,220.59 54.78,221.67 54.78,224.17 | 54.78,224.17 54.54,224.41 54.54,224.71 J18.2 | 43.38,216.15 43.34,216.15 41.2,218.29
N$66  (via drill 0.6 pad 1.93)
  other vias: 69.88,224.5
N$67  (via drill 0.6 pad 1.93)
  other vias: 60.43,222.96
N$68
  Bottom 0.813: X10.1 46.42,152.5 55.21,161.29 56.9,161.29 J15.1
N$69
  Bottom 0.813: X10.2 45.92,149.96 54.17,141.71 55.94,141.71 J19.1
N$70
  Bottom 0.813: X3.1 67.09,223.29 68,222.38 69.78,222.38 71.45,220.71 71.45,215.83 70.14,214.52 69.07,214.52 68.12,213.56 68.12,202.36 67.4,201.64 67.4,172.44 63.71,168.75 36.53,168.75 X4.3
N$71
  Bottom 0.813: X4.2 38.33,184.61 39.77,183.17 39.77,173.52 42.39,170.89 63.59,170.89 65.61,172.92 65.61,202.6 66.21,203.19 66.21,215.11 67.04,215.95 68.47,215.95 69.66,217.14 69.66,219.52 68.47,220.71 | X3.2 65,228.56 63.47,227.03 63.47,221.79 64.54,220.71 68.47,220.71 | 68.47,220.71 | 68.47,220.71 69.55,219.64
N$72  (1 unrouted)
  Bottom 0.813: X5.3 29.26,210.01 31.2,211.95 31.2,216.29 29.87,217.62 23.98,217.62 22.09,219.51 22.09,224.85 27.31,230.08 59.32,230.08 60.65,228.74 60.65,223.4 60.43,223.18
  Bottom 1.016: X3.3 69.63,224.29 69.72,224.19
N$73
  Bottom 0.813: X5.2 23.56,215.01 | 21.07,227.27 25.72,231.92 66.27,231.92 X3.4 | 21.06,227.27 19.84,226.06 19.84,216.41
  Bottom 1.016: 21.07,227.27 21.06,227.27 | 19.84,216.41 21.55,214.7 23.24,214.7 23.56,215.01
N$74
  Bottom 0.813: R18.1 74.23,168.48 70.97,171.73 70.97,212.73 73.12,214.87 73.12,223.1 72.28,223.93 72.28,225.91 X3.5
N$75
  Bottom 0.813: 82.88,223.57 81.81,222.5 77.64,222.5 76.45,221.31 76.45,204.47 74.39,202.41 74.39,202.4 72.83,200.85 72.83,188.47 R19.1
  Bottom 1.016: 77.64,222.5 82.18,222.5 83.56,223.88 83.56,233.68 82.78,234.46 72.99,234.46 72.06,233.52 72.06,228.67 X3.6
N$76
  Bottom 0.813: X3.7 74.71,206.04 R20.1
N$77
  Bottom 0.813: X10.3 41.14,156.53 J20.1
N$78
  Bottom 0.813: J21.1 45.66,142.8 41.27,147.19 41.27,149.83 X10.4
N$79
  Bottom 0.813: J22.1 36.56,161.32 38.69,159.2 38.69,152.59 X10.5
N$80
  Bottom 0.813: J23.1 35.75,141.75 38.69,144.69 38.69,149.87 X10.6
N$81
  Bottom 0.813: J24.1 24.79,161.25 30.87,155.17 34.58,155.17 35.79,153.96 35.79,152.77 X10.7
N$82
  Bottom 0.813: J25.1 25.17,141.57 30.31,146.71 34.58,146.71 36.03,148.16 36.03,149.93 X10.8
N$83
  Bottom 0.813: J15.2 56.83,163.93 J20.2 45.93,163.86 J22.2 34.75,163.79 J24.2 22.97,163.79 22.89,163.71 21.04,163.71 19.43,162.1 19.43,154.77 | J19.2 45.98,139.05 J21.2 34.47,139.37 | 34.47,139.37 J23.2 23.6,139.21 J25.2 | 34.47,139.37 20.64,139.37 19.43,140.58 19.43,154.77 | X10.9 21.69,152.5 19.43,154.77
N$84
  Bottom 0.813: X11.1 100.98,151.85 J26.1
N$85
  Bottom 0.813: X11.2 100.61,148.74 J27.1
N$86
  Bottom 0.813: X11.3 98.07,157.44 J28.1
N$87
  Bottom 0.813: X11.4 98.07,142.98 J29.1
N$88
  Bottom 0.813: J30.1 93.03,158.46 95.35,156.13 95.35,152.02 X11.5
N$89
  Bottom 0.813: X11.6 95.53,145.85 J31.1
N$90
  Bottom 0.813: J32.1 82.61,158.31 87.05,153.88 91.72,153.88 92.93,152.67 92.93,151.9 X11.7
N$91
  Bottom 0.813: X11.8 92.99,147.57 91.4,145.98 86.68,145.98 J33.1
N$92
  Bottom 0.813: J26.2 107.92,161.33 107.92,161.53 107.61,161.22 J28.2 99.09,161 J30.2 91.58,160.73 92.05,160.73 92.05,160.97 91.93,160.85 J32.2 82.48,160.97 79.96,160.97 78.1,159.12 78.1,153.56 | J33.2 90.97,139.12 J31.2 | J31.2 99.5,138.94 J29.2 107.83,138.97 J27.2 | J31.2 79.27,138.94 78.1,140.1 78.1,153.56 | X11.9 79.81,151.85 78.1,153.56
N$93
  Bottom 0.813: 21.36,152.35 | 21.36,152.35 19.75,150.74 19.75,153.23 20.07,153.56 20.07,152.99 20.72,152.35 20.56,152.35 20.31,152.11
N$94
  Bottom 0.813: 79.71,151.7 79.71,151.38 78.34,150.01 78.34,151.86 78.75,152.27 78.75,151.7 79.07,151.38
N$95
  Bottom 0.813: X12.2 X12.1
N$96
  Bottom 0.813: X12.6 X12.5 35.02,90.39 40.1,85.31 R21.1
N$97
  Bottom 0.813: X14.1 9.25,115.76 7.58,114.1 7.58,98.2 9.27,96.51 11.93,96.51 C7.+ 8.35,92.93 IC3.1
N$98
  Bottom 0.813: R21.2 42.64,89.12 OK1.1
N$99
  Bottom 0.813: OK1.3 56.61,84.04 57.88,85.31 R22.2 56.61,87.85 55.34,89.12 55.34,91.66 57.88,94.2 60.42,94.2 X13.6 X13.5
N$100
  Bottom 0.813: X12.3 X12.4 29.94,87.85 28.67,86.58 28.67,81.5 33.75,76.42 41.37,76.42 45.18,80.23 OK1.2 46.45,84.04 47.72,85.31 47.72,92.93 46.45,94.2 OK2.2
N$101
  Bottom 0.813: X12.8 X12.7 R23.1
N$102
  Bottom 0.813: R23.2 40.1,101.82 OK2.1
N$103
  Bottom 0.813: OK2.3 55.34,94.2 57.88,96.74 R24.2 57.88,99.28 X13.8 X13.7
N$104
  Bottom 0.813: X15.2 X15.1
N$105
  Bottom 0.813: X15.6 X15.5 35.02,59.91 37.56,57.37 37.56,48.48 R25.1
N$106
  Bottom 0.813: R25.2 41.37,56.1 OK3.1
N$107
  Bottom 0.813: X16.5 X16.6 57.88,62.45 55.34,59.91 55.34,58.64 R26.2 57.9,56.08 57.9,52.52 55.13,49.75 OK3.3
N$108
  Bottom 0.813: X15.4 31.8,57.37 | 31.8,57.37 X15.3 | OK3.2 46.45,49.75 47.72,51.02 47.72,61.18 OK4.2 38.95,63.72 35.4,67.27 30.09,67.27 28.2,65.38 28.2,59.2 30.25,57.14 31.57,57.14 31.8,57.37
N$109
  Bottom 0.813: X15.8 X15.7 37.56,62.45 R27.1
N$110
  Bottom 0.813: OK4.1 43.91,66.26 R27.2
N$111
  Bottom 0.813: X16.7 X16.8 57.88,64.99 | OK4.3 56.61,63.72 57.88,64.99 | 57.88,64.99 R28.2
N$112
  Bottom 0.813: X17.2 X17.1
N$113
  Bottom 0.813: X17.6 X17.5 35.02,118.33 40.1,113.25 R29.1
N$114
  Bottom 0.813: R29.2 40.1,115.79 OK5.1
N$115
  Bottom 0.813: X18.5 X18.6 59.3,123.26 55.86,123.26 54.41,121.81 54.41,118.23 55.58,117.06 R30.2 57.92,117.03 57.92,110.53 55.55,108.17 OK5.3
N$116
  Bottom 0.813: X17.3 X17.4 31.13,115.87 30.35,115.87 28.83,114.35 28.83,108.78 32.49,105.12 42.84,105.12 45.18,107.47 OK5.2 46.45,108.17 47.72,109.44 47.72,124.68 46.45,125.95 OK6.2
N$117
  Bottom 0.813: X17.8 X17.7 38.83,120.87 R31.1
N$118
  Bottom 0.813: R31.2 41.37,132.3 OK6.1
N$119
  Bottom 0.813: X18.7 X18.8 57.88,127.22 R32.2 58.22,130.69 58.22,128.29 55.88,125.95 OK6.3
N$120
  Bottom 0.813: X19.2 X19.1
N$121
  Bottom 0.813: X19.6 X19.5 81.8,118.33 84.56,115.56 84.56,111.34 R33.1
N$122
  Bottom 0.813: R33.2 86.79,115.16 88.83,113.13 92.93,113.13 OK7.1
N$123
  Bottom 0.813: X20.5 X20.6 113.74,118.31 112.05,118.31 111.44,118.92 111.44,121.13 108.7,123.87 105.2,123.87 104.44,123.11 104.44,120.21 105.38,119.27 R34.2 107.11,114.88 102.68,110.46 100.84,110.46 OK7.3
N$124
  Bottom 0.813: OK7.2 93.29,110.53 94.46,110.53 95.68,111.75 95.68,127.22 94.56,128.34 OK8.2 92.86,128.06 78.78,128.06 74.51,123.8 74.51,116.71 75.43,115.79 X19.3 X19.4
N$125
  Bottom 0.813: X19.8 X19.7 84.08,120.87 85.17,121.97 86.77,121.97 R35.1
N$126
  Bottom 0.813: R35.2 91.87,132.15 OK8.1
N$127
  Bottom 0.813: OK8.3 105.85,128.34 106.19,128.67 | 106.19,128.67 107.18,129.66 107.18,132.08 R36.2 | X20.7 X20.8 113.32,120.87 113.32,121.54 106.19,128.67
N$128
  Bottom 0.813: X21.1 X21.2
N$129
  Bottom 0.813: X21.6 X21.5 81.3,90.39 86.93,84.75 86.93,79.8 R37.1
N$130
  Bottom 0.813: R37.2 90.6,89.81 OK9.1
N$131
  Bottom 0.813: OK9.3 104.58,84.73 107.34,87.5 107.34,89.58 R38.2 104.88,89.81 103.53,91.16 103.53,93.91 105.21,95.59 107.79,95.59 112.82,90.55 113.6,90.55 X22.6 X22.5
N$132
  Bottom 0.813: X21.3 X21.4 76.83,87.96 75.82,87.96 73.99,86.13 73.99,81.24 77.5,77.73 89.83,77.73 93.14,81.05 OK9.2 93.27,84.6 94.7,84.6 95.92,85.82 95.92,98.03 94.75,99.2 OK10.2
N$133
  Bottom 0.813: X21.8 79.38,92.93 79.47,92.84 | R39.1 86.68,92.69 79.62,92.69 79.47,92.84 | X21.7 79.47,92.84
N$134
  Bottom 0.813: R39.2 92.27,103.41 OK10.1
N$135
  Bottom 0.813: R40.2 106.65,100.69 105.74,99.78 | 105.74,99.78 104.9,98.94 101.82,98.94 OK10.3 | X22.7 X22.8 112.59,92.93 105.74,99.78
N$136
  Bottom 0.813: R41.1 78.24,20.87 83.89,26.53 83.89,36.46 X23.1
N$137
  Bottom 0.813: R41.2 88.73,20.67 92.4,24.34 92.4,30.58 93.45,31.63 96.02,31.63 OK11.1
N$138
  Bottom 0.813: R42.1 80.34,25.56 81.38,26.61 81.38,36.49 X23.2
N$139
  Bottom 0.813: R42.2 88.44,30.19 92.4,34.14 92.4,40.46 94.02,42.08 96.11,42.08 OK12.1
N$140
  Bottom 0.813: R45.1 79.99,16.87 86.24,23.13 86.24,31.88 86.97,32.6 86.97,37.79 85.68,39.09 84.7,39.09 84.62,39.17 84.1,39.17 X23.3
N$141
  Bottom 0.813: R45.2 88.65,16.87 93.12,21.34 96.2,21.34 OK13.1
N$142
  Bottom 0.813: OK11.3 103.89,29.03 110.3,22.62 111.18,22.62 R43.2 114.16,25.6 114.16,30.24 117.91,33.99 X24.1
N$143
  Bottom 0.813: X24.2 113.44,35.08 111.48,35.08 111.48,26.65 R44.2 111.08,26.25 110.01,26.25 107.17,29.08 107.17,36.32 103.87,39.63 OK12.3
N$144
  Bottom 0.813: X24.3 119.15,39.54 120.28,38.41 120.28,32.17 115.88,27.77 115.88,23.1 R46.2 110.95,18.85 OK13.3
N$145
  Bottom 0.813: R47.2 95.03,12.55 OK14.1
N$146  (1 unrouted)
  Bottom 0.813: OK14.3 108.11,8.94 111.59,12.41 111.59,14.31 R48.2 110.14,14.48 108.59,16.03 | X24.4 110.96,39.54 109.16,37.74 109.16,30.22
N$147
  Bottom 0.813: R49.2 91.1,60.63 92.8,62.34 96.18,62.34 OK15.1
N$148
  Bottom 0.813: OK15.3 104.23,59.46 107.29,59.46 111.52,63.68 R50.2 122.65,52.75 122.65,44.1 120.63,42.08 X24.5
N$149
  Bottom 0.813: R51.2 88.17,66.06 93.45,71.33 96.65,71.33 OK16.1
N$150
  Bottom 0.813: R53.2 92.37,55.5 OK17.1
N$151
  Bottom 0.813: X23.9 84.08,48.14 | 84.08,48.14 79.6,52.62 | 84.08,48.14 | 84.08,48.14 79.68,52.53 77.74,52.53 75.96,54.32 75.96,61.77 77.17,62.99 82.44,62.99 83.81,64.36 83.81,72.39 86.97,75.54 97.5,75.54 98.61,74.42 98.61,69.13 | 98.61,69.13 98.61,60 | 98.61,60 98.61,48.72 | 98.61,48.72 98.61,39.48 | 98.61,39.48 98.61,28.63 | 98.61,28.63 98.61,18.96 | 98.61,18.96 98.61,10.06 97.42,8.87 96.17,8.87 OK14.2 | OK13.2 98.49,18.85 98.61,18.96 | OK11.2 98.21,29.03 98.61,28.63 | OK12.2 98.41,39.68 98.61,39.48 | OK17.2 98.26,49.07 98.61,48.72 | OK15.2 98.03,59.41 98.61,60 | OK16.2 98.33,68.85 98.61,69.13
N$152
  Bottom 0.813: 104.02,48.93 OK17.3 103.91,49.04 104.5,49.04 104.61,48.93 104.72,48.93 104.82,49.04 106.11,49.04 107.19,50.11 107.19,56.24 110.59,59.64 R54.2 111.87,59.35 112.02,59.35 120.71,50.65 120.71,45.93 119.41,44.62 X24.7
N$153
  Bottom 0.813: R47.1 77.05,12.55 75.31,14.29 75.31,33.98 80.33,39 81.35,39 X23.4
N$154
  Bottom 0.813: R49.1 80,60.63 87.46,53.18 87.46,43.22 86.32,42.08 84.43,42.08 X23.5
N$155
  Bottom 0.813: X23.6 77.53,41.73 75.39,43.87 75.39,44.03 74.26,45.16 74.26,64.04 75.47,65.25 77.95,65.25 R51.1
N$156
  Bottom 0.813: R53.1 80.2,55.5 86,49.7 86,44.92 85.51,44.43 84.24,44.43 X23.7
N$157  (1 unrouted)
  Bottom 0.813: OK16.3 105.37,67.8 R52.2 108.9,67.8 108.59,68.11 108.59,64.7 108.87,64.42 | X24.6 111.67,42.08 109.33,44.42 109.33,54.41 109.23,54.52
N$158
  Bottom 0.813: X25.2 X25.1
N$159
  Bottom 0.813: X25.6 X25.5 36.07,30.31 36.88,29.49 36.88,20.25 R55.1
N$160
  Bottom 0.813: R55.2 42.15,27.36 OK18.1
N$161
  Bottom 0.813: X26.5 X26.6 63.27,29.97 60.24,33 56.39,33 55.79,32.41 55.79,27.61 57.16,26.24 58.49,26.24 R56.2 58.61,26.32 58.61,25.81 58.7,25.73 58.7,22.9 57.8,22.01 OK18.3
N$162
  Bottom 0.813: X25.3 X25.4 29.69,27.78 28.24,26.33 28.24,18.19 32.35,14.09 41.33,14.09 44.96,17.72 OK18.2 45,22.05 46.03,22.05 46.89,22.9 46.89,33.35 45.88,34.35 OK19.2
N$163
  Bottom 0.813: X25.8 X25.7 38.53,32.85 R57.1
N$164
  Bottom 0.813: R57.2 40.01,39.29 42.44,36.86 44.93,36.86 OK19.1
N$165
  Bottom 0.813: X26.7 X26.8 63.98,32.51 58.61,37.88 | OK19.3 55.08,34.35 58.61,37.88 | 58.61,37.88 58.61,39.85 R58.2
N$166
  Bottom 0.813: J34.1 11.89,55.31 R59.2
N$167
  Bottom 0.813: R59.1 7.44,45.51 8.69,46.76 12.46,46.76 OK20.1
N$168
  Bottom 0.813: J34.2 17.18,55.04 17.18,53.67 14.59,51.08 14.59,45.46 13.29,44.17 12.88,44.17 OK20.2
N$169
  Bottom 0.813: OK20.3 20.5,44.17 23.8,44.17 25.24,42.73 R61.2 25.53,40.7 25.53,40.57 25.38,40.42 25.38,35.38 21.78,31.78 14.88,31.78 14.08,32.58 J36.1
N$170
  Bottom 0.813: R60.2 9.08,24.07 J35.1
N$171
  Bottom 0.813: R60.1 7.7,18.48 9.43,20.21 12.04,20.21 12.11,20.14 12.76,20.14 OK21.1
N$172
  Bottom 0.813: OK21.2 13.66,17.57 15.15,19.05 15.15,24.91 16.67,26.43 16.67,29.02 J35.2
N$173
  Bottom 0.813: OK21.3 21.85,17.57 R62.2 25.42,13.83 25.42,7.69 22.6,4.87 15.44,4.87 13.94,6.37 J37.1
N$174  (via drill 0.6 pad 1.93)
  other vias: 109.33,54.52
N$175  (via drill 0.6 pad 1.93)
  other vias: 108.45,16.31
N$176  (via drill 0.6 pad 1.93)
  other vias: 108.59,64.84
N$177  (via drill 0.6 pad 1.93)
  other vias: 109.22,30.16
VCC
  Bottom 0.813: 51.53,96.74 50.26,98.01 50.26,102.88 51.82,104.44 | 51.53,96.74 OK2.4 | 51.53,86.58 50.26,87.85 50.26,95.47 51.53,96.74 | X13.1 X13.2 61.69,85.31 56.61,80.23 50.26,80.23 | OK1.4 51.53,86.58 | 51.53,86.58 50.26,85.31 50.26,80.23 | OK4.4 51.53,66.26 | 51.53,66.26 50.26,64.99 50.26,53.56 51.53,52.29 OK3.4 51.79,52.29 50.65,51.15 50.65,45.32 | X16.1 X16.2 64.23,51.65 61.56,48.98 57.4,48.98 54.13,45.71 51.04,45.71 50.65,45.32 | 50.26,80.23 50.26,67.53 51.53,66.26 | OK6.4 51.19,128.49 50.38,127.68 50.38,111.68 51.37,110.69 52.78,110.69 OK5.4 51.54,110.71 50.83,110 50.83,105.43 51.82,104.44 | X18.1 X18.2 64.16,113.18 64.16,106.19 62.41,104.44 51.82,104.44 | X20.1 X20.2 113.76,111.89 108.14,106.27 98.49,106.27 98.2,106.56 | OK8.4 99.26,130.88 98.5,130.12 98.5,113.81 99.26,113.05 | 99.26,113.05 100.63,113.05 OK7.4 | X22.1 X22.2 109.06,85.31 105.39,81.64 104.18,81.64 | OK10.4 100.29,101.74 | 100.29,101.74 98.2,103.83 | 98.2,103.83 98.2,106.56 | 98.2,106.56 98.2,111.99 99.26,113.05 | OK9.4 100.72,87.27 100.34,87.65 | 100.34,87.65 98.51,89.48 98.51,99.95 100.29,101.74 | 98.36,85.67 100.34,87.65 | IC3.3 8.35,64.99 C8.+ 10.89,57 2.33,48.44 2.33,11.17 11.06,2.44 29.26,2.44 | 98.2,103.83 98.2,103.78 100.19,101.79 100.19,101.62 98.47,99.91 98.47,89.42 100.53,87.37 100.02,87.37 98.17,85.52 98.17,82.98 | OK18.4 51.66,24.55 | 51.66,24.55 50.48,25.73 50.48,36.34 51.17,37.03 52.02,37.03 | 52.02,37.03 52.45,37.03 OK19.4 | X26.1 X26.2 66.31,20.07 60.06,13.83 50.88,13.83 50.54,13.48 | 50.57,15.37 50.57,23.46 51.66,24.55 | 50.65,45.32 50.65,44.25 | 50.65,44.25 50.65,43.97 | 50.65,43.97 50.65,38.4 52.02,37.03
  Bottom 0.813: 101.5,12.52 101.5,21.54 | 101.5,21.54 101.5,31.32 | 101.5,31.32 101.5,42.49 | 101.5,42.49 101.5,51.4 | 101.5,51.4 101.5,61.93 | 101.5,61.93 101.5,69.88 103.11,71.49 104.22,71.49 | 104.22,71.49 OK16.4 | OK15.4 102.06,61.95 102.03,61.93 101.5,61.93 | OK17.4 101.7,51.61 101.5,51.4 | OK12.4 101.76,42.22 101.5,42.49 | OK13.4 101.65,21.39 101.5,21.54 | OK11.4 101.75,31.57 101.5,31.32 | 104.22,71.49 104.22,81.6 104.18,81.64 | 104.18,81.64 99.5,81.64 98.17,82.98 | 98.17,82.98 98.17,82.82 99.23,81.75 103.63,81.75 104.19,81.19 104.19,71.94 103.63,71.37 103.06,71.37 101.5,69.81 101.5,11.35 | 101.5,11.35 101.5,7.23 96.71,2.44 50.54,2.44 | OK14.4 101.63,11.48 101.5,11.35 | J36.3 19.16,40.46 18.48,41.14 18.48,46.61 18.91,47.05 20.16,47.05 | 20.16,47.05 OK20.4 | OK21.4 19.31,20.11 18.69,19.48 18.69,13.26 19.13,12.83 19.13,12.82 | 19.13,8.2 19.13,8.61 | 19.13,8.61 J37.3 | 50.58,43.9 50.65,43.97 | 29.26,2.44 50.54,2.44 | 19.13,8.61 19.13,12.82 | 19.13,12.82 18.81,13.14 18.81,19.53 19.3,20.03 22.74,20.03 29.39,13.38 29.39,2.56 29.26,2.44 | 28.72,47.05 28.93,47.05 31.97,44.01 50.41,44.01 50.65,44.25 | 20.16,47.05 28.72,47.05 | 28.72,47.05 31.63,44.14 49.6,44.14 50.59,43.15 50.59,38.71 52.06,37.23 51.42,37.23 50.47,36.29 50.47,25.63 51.76,24.33 51.44,24.33 50.54,23.43 50.54,13.48 | 50.54,13.48 50.54,2.44

### Text on the board
Bottom: TR SKNCOE